# Altium schematic sheet infant_temperature_solar_1.SchDoc
size 431 x 279 mm
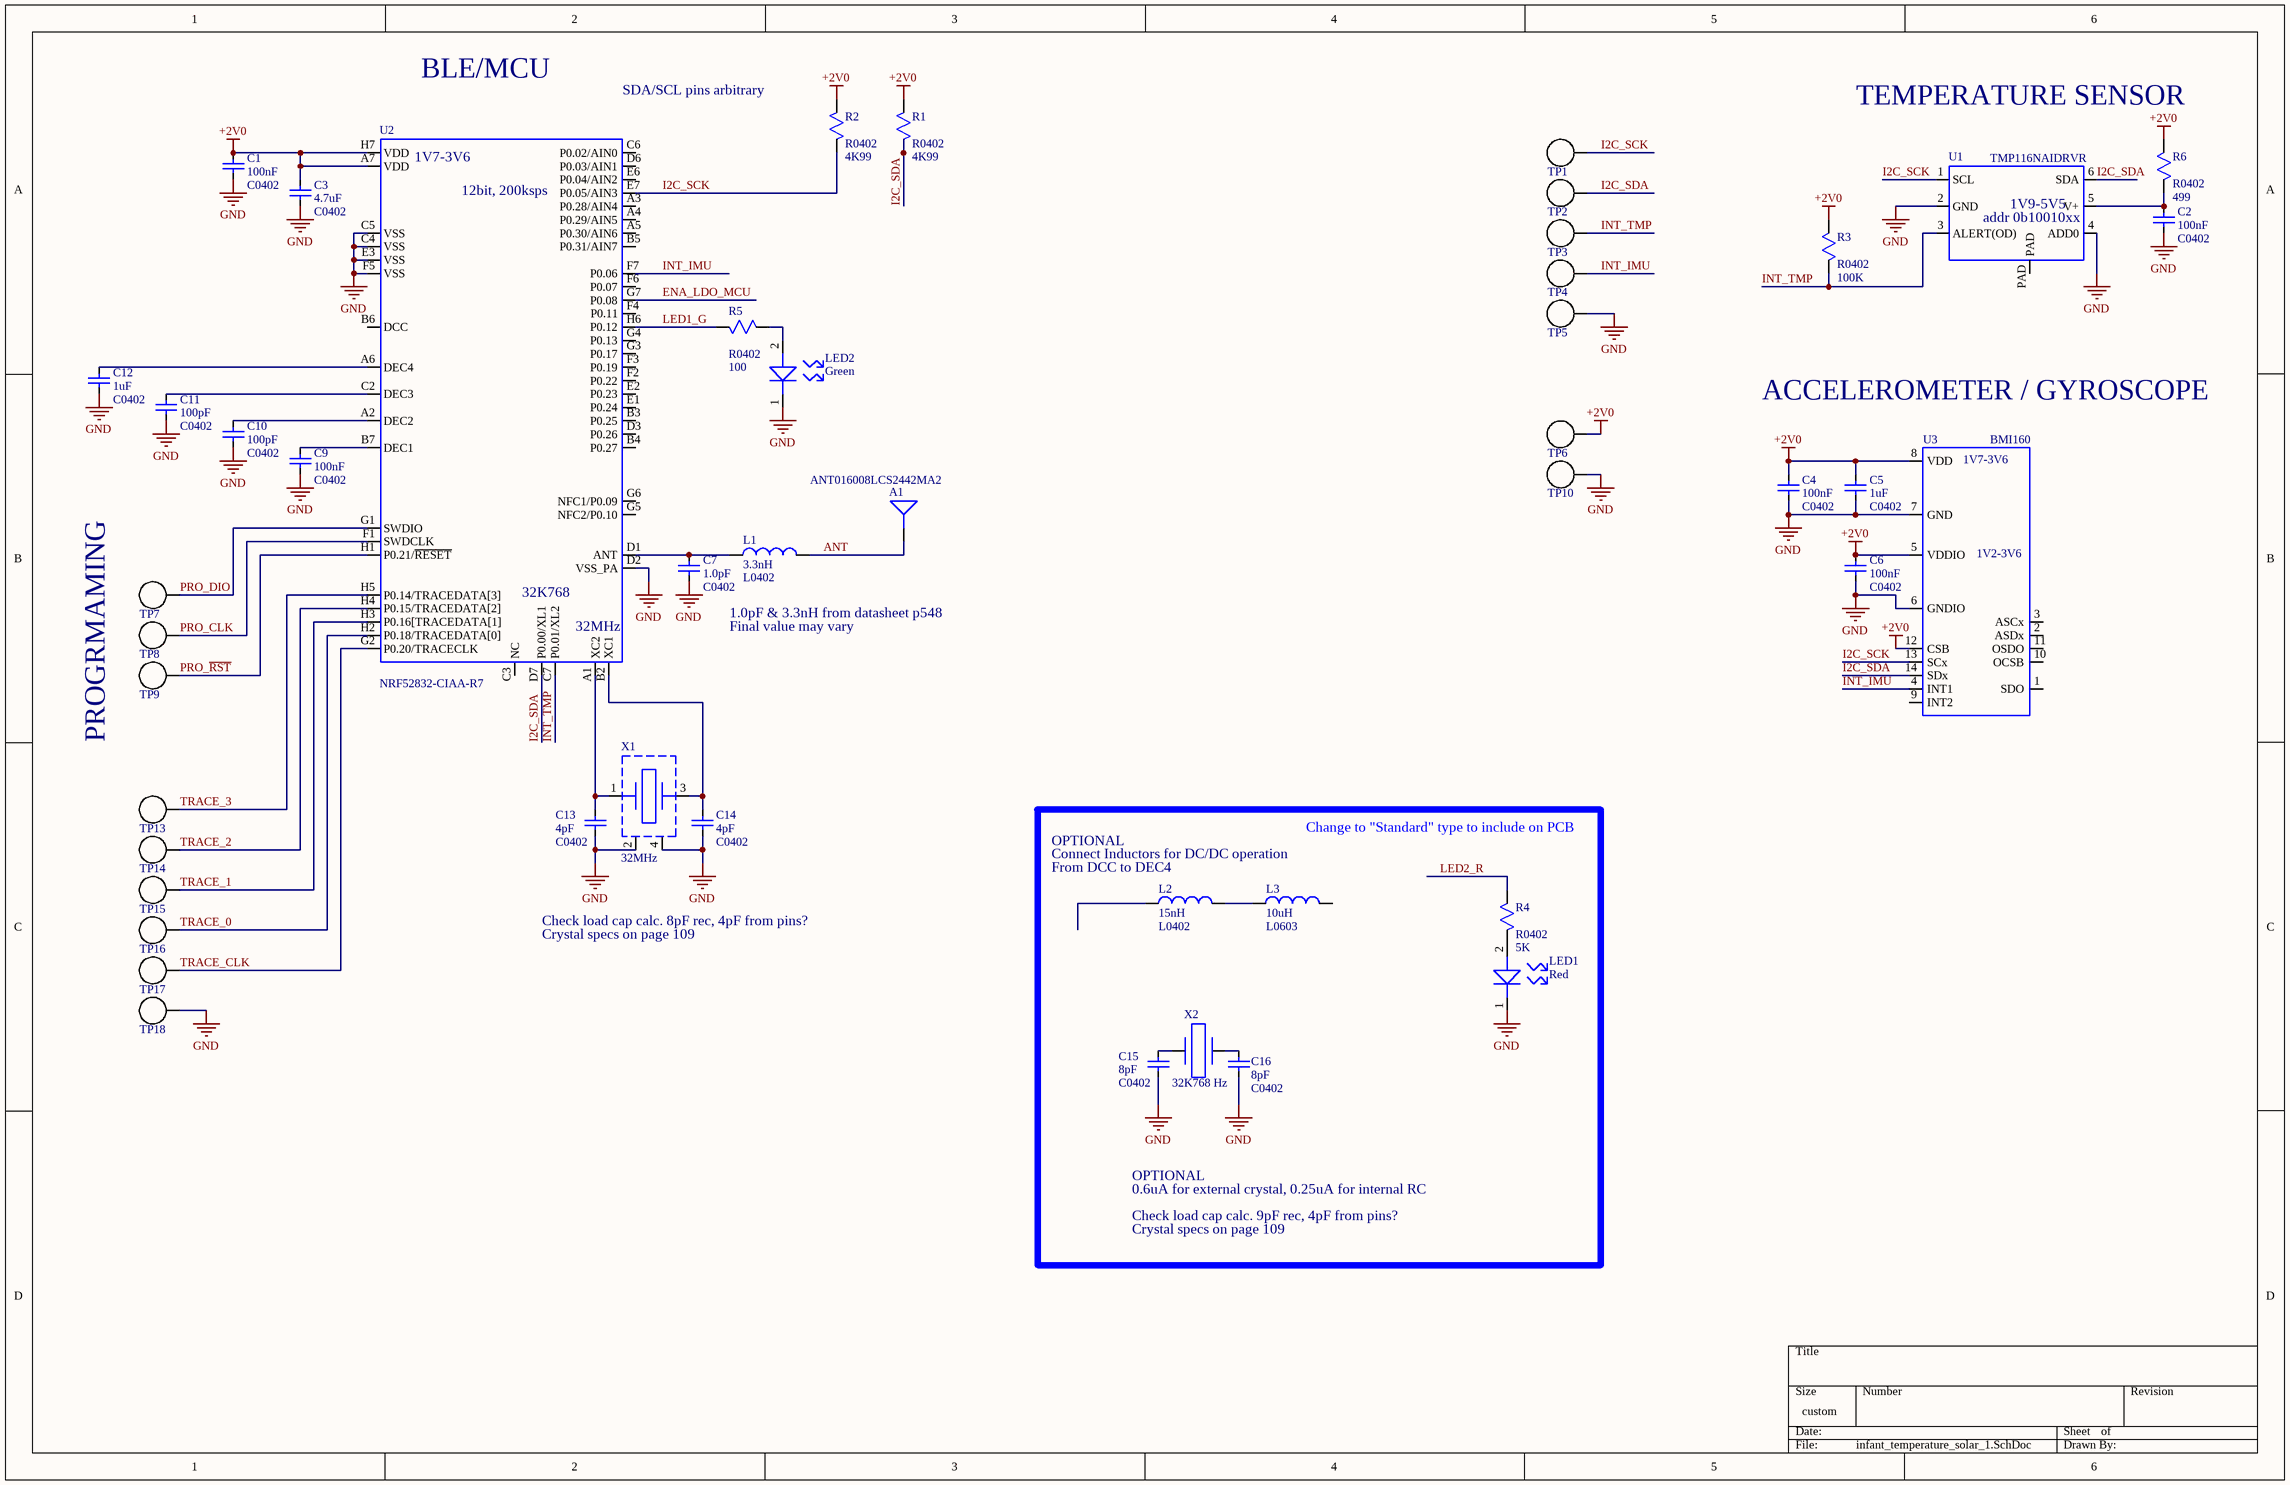
[diagram p0: infant_temperature_solar_1.SchDoc]

## Parts
A1  ANT016008LCS2442MA2  [ANT016008LCS]
C1  100nF  [C0402]
C2  100nF  [C0402]
C3  4.7uF  [C0402]
C4  100nF  [C0402]
C5  1uF  [C0402]
C6  100nF  [C0402]
C7  1.0pF  [C0402]
C9  100nF  [C0402]
C10  100pF  [C0402]
C11  100pF  [C0402]
C12  1uF  [C0402]
C13  4pF  [C0402]
C14  4pF  [C0402]
C15  8pF  [C0402]  (graphical)
C16  8pF  [C0402]  (graphical)
L1  value 3.3nH  [L0402]  (hidden comment: IND)
L2  value 15nH  [L0402]  (hidden comment: IND)  (graphical)
L3  value 10uH  [L0603]  (hidden comment: IND)  (graphical)
LED1  Red  [LED_0402]  (graphical)
LED2  Green  [LED_0402]
R1  value 4K99  [R0402]  (hidden comment: Resistor)
R2  value 4K99  [R0402]  (hidden comment: Resistor)
R3  value 100K  [R0402]  (hidden comment: Resistor)
R4  value 5K  [R0402]  (hidden comment: Resistor)  (graphical)
R5  value 100  [R0402]  (hidden comment: Resistor)
R6  value 499  [R0402]  (hidden comment: Resistor)
TP1  Not A Part  [TP_32AWG_1X0.5MM_ROUND]  (value not drawn)  (no BOM)
TP2  Not A Part  [TP_32AWG_1X0.5MM_ROUND]  (value not drawn)  (no BOM)
TP3  Not A Part  [TP_32AWG_1X0.5MM_ROUND]  (value not drawn)  (no BOM)
TP4  Not A Part  [TP_32AWG_1X0.5MM_ROUND]  (value not drawn)  (no BOM)
TP5  Not A Part  [TP_32AWG_1X0.5MM_ROUND]  (value not drawn)  (no BOM)
TP6  Not A Part  [TP_32AWG_1X0.5MM_ROUND]  (value not drawn)  (no BOM)
TP7  Not A Part  [TP_32AWG_1X0.5MM_ROUND]  (value not drawn)  (no BOM)
TP8  Not A Part  [TP_32AWG_1X0.5MM_ROUND]  (value not drawn)  (no BOM)
TP9  Not A Part  [TP_32AWG_1X0.5MM_ROUND]  (value not drawn)  (no BOM)
TP10  Not A Part  [TP_32AWG_1X0.5MM_ROUND]  (value not drawn)  (no BOM)
TP13  Not A Part  [TP_32AWG_1X0.5MM_ROUND]  (value not drawn)  (no BOM)
TP14  Not A Part  [TP_32AWG_1X0.5MM_ROUND]  (value not drawn)  (no BOM)
TP15  Not A Part  [TP_32AWG_1X0.5MM_ROUND]  (value not drawn)  (no BOM)
TP16  Not A Part  [TP_32AWG_1X0.5MM_ROUND]  (value not drawn)  (no BOM)
TP17  Not A Part  [TP_32AWG_1X0.5MM_ROUND]  (value not drawn)  (no BOM)
TP18  Not A Part  [TP_32AWG_1X0.5MM_ROUND]  (value not drawn)  (no BOM)
U1  MfgPartNumber: TMP116NAIDRVR  [WSON-6_PAD]  (hidden comment: TMP116)
U2  MfgPartNumber: NRF52832-CIAA-R7  [XFBGA-50]  (hidden comment: NRF52832_BGA)
U3  MfgPartNumber: BMI160  [LGA-14]  (hidden comment: BMI160_ALTERNATE)
X1  32MHz  [CRYSTAL_1MM6_X_1MM2]
X2  32K768 Hz  [CRYSTAL_1MM2_X_1MM0]  (graphical)

## Nets
+2V0: C1.1 C3.1 C4.1 C5.1 C6.1 R1.1 R2.1 R3.1 R6.1 TP6.1(MTG) U2.A7(VDD) U2.H7(VDD) U3.5(VDDIO) U3.8(VDD) U3.12(CSB)
GND: C1.2 C2.2 C3.2 C4.2 C5.2 C6.2 C7.2 C9.2 C10.2 C11.2 C12.2 C13.1 C14.1 C15.1 C16.1 LED1.1 LED2.1 TP5.1(MTG) TP10.1(MTG) TP18.1(MTG) U1.2(GND) U1.4(ADD0) U2.C4(VSS) U2.C5(VSS) U2.D2(VSS_PA) U2.E3(VSS) U2.F5(VSS) U3.6(GNDIO) U3.7(GND) X1.2(GND) X1.4(GND)
ANT: A1.4(FEED) L1.2
ENA_LDO_MCU: U2.G7(P0.08)
I2C_SCK: R2.2 TP1.1(MTG) U1.1(SCL) U2.E7(P0.05/AIN3) U3.13(SCx)
I2C_SDA: R1.2 TP2.1(MTG) U1.6(SDA) U2.D7(P0.00/XL1) U3.14(SDx)
INT_IMU: TP4.1(MTG) U2.F7(P0.06) U3.4(INT1)
INT_TMP: R3.2 TP3.1(MTG) U1.3(ALERT(OD)) U2.C7(P0.01/XL2)
LED1_G: R5.1 U2.H6(P0.12)
LED2_R: R4.1
PRO_CLK: TP8.1(MTG) U2.F1(SWDCLK)
PRO_DIO: TP7.1(MTG) U2.G1(SWDIO)
PRO_~{RST}: TP9.1(MTG) U2.H1(P0.21/~{RESET})
TRACE_0: TP16.1(MTG) U2.H2(P0.18/TRACEDATA[0])
TRACE_1: TP15.1(MTG) U2.H3(P0.16[TRACEDATA[1])
TRACE_2: TP14.1(MTG) U2.H4(P0.15/TRACEDATA[2])
TRACE_3: TP13.1(MTG) U2.H5(P0.14/TRACEDATA[3])
TRACE_CLK: TP17.1(MTG) U2.G2(P0.20/TRACECLK)
NetC2_1: C2.1 R6.2 U1.5(V+)
NetC7_1: C7.1 L1.1 U2.D1(ANT)
NetC9_1: C9.1 U2.B7(DEC1)
NetC10_1: C10.1 U2.A2(DEC2)
NetC11_1: C11.1 U2.C2(DEC3)
NetC12_1: C12.1 U2.A6(DEC4)
NetC13_2: C13.2 U2.A1(XC2) X1.1
NetC14_2: C14.2 U2.B2(XC1) X1.3
NetC15_2: C15.2 X2.2
NetC16_2: C16.2 X2.1
NetL2_2: L2.2 L3.1
NetLED1_2: LED1.2 R4.2
NetLED2_2: LED2.2 R5.2

Not connected (* = marked no-connect by the designer): L2 1; L3 2; U1 PAD; U2 A3(P0.28/AIN4) A4(P0.29/AIN5) A5(P0.30/AIN6) B3(P0.25) B4(P0.27) B5(P0.31/AIN7) B6(DCC) C3(NC) C6(P0.02/AIN0) D3(P0.26) D6(P0.03/AIN1) E1(P0.24) E2(P0.23) E6(P0.04/AIN2) F2(P0.22) F3(P0.19) F4(P0.11) F6(P0.07) G3(P0.17) G4(P0.13) G5(NFC2/P0.10) G6(NFC1/P0.09); U3 1(SDO) 2(ASDx) 3(ASCx) 9(INT2) 10(OCSB) 11(OSDO)

## Notes on the sheet
- BLE/MCU
- SDA/SCL pins arbitrary
- TEMPERATURE SENSOR
- ACCELEROMETER / GYROSCOPE
- 1.0pF & 3.3nH from datasheet p548
- Final value may vary
- PROGRMAMING
- Change to "Standard" type to include on PCB
- Connect Inductors for DC/DC operation
- OPTIONAL
- (near L2) From DCC to DEC4
- Crystal specs on page 109
- Check load cap calc. 8pF rec, 4pF from pins?
- Check load cap calc. 9pF rec, 4pF from pins?
- 0.6uA for external crystal, 0.25uA for internal RC
- (in symbol BMI160_ALTERNATE) 1V7-3V6; 1V2-3V6
- (in symbol NRF52832_BGA) 1V7-3V6; 12bit, 200ksps; 32K768; 32MHz
- (in symbol TMP116) 1V9-5V5; addr 0b10010xx

## Library data of the parts
A1 = ANT016008LCS2442MA2: ANTENNA 2.4GHZ SMD; Manufacturer: TDK; DigikeyPartNumber: 445-172405CT-ND; MfgPartNumber: ANT016008LCS2442MA2
C1 C2 C4 C6 C9 = CAP: Nonpolarized capacitor; Manufacturer: Samsung; MfgPartNumber: CL05F104ZA5NNNC; VoltageRating: 25V; DigikeyPartNumber: 1276-1739-1-ND; Value: 100nF; Package: C0402
C3 = CAP: Nonpolarized capacitor; Manufacturer: Murata; MfgPartNumber: GRM155R61A475MEAAD; VoltageRating: 10V; DigikeyPartNumber: 490-14306-1-ND; Value: 4.7uF; Package: C0402
C5 C12 = CAP: Nonpolarized capacitor; Manufacturer: Taiyo Yuden; MfgPartNumber: TMK105BJ105MV-F; VoltageRating: 25V; DigikeyPartNumber: 587-3245-1-ND; Value: 1uF; Package: C0402
C7 = CAP: Nonpolarized capacitor; Manufacturer: Murata; MfgPartNumber: GRM1555C1E1R0BA01D; VoltageRating: 25V; DigikeyPartNumber: 490-11362-1-ND; Value: 1.0pF; Package: C0402
C10 C11 = CAP: Nonpolarized capacitor; Manufacturer: Yageo; MfgPartNumber: CC0402KRX7R8BB101; VoltageRating: 25V; DigikeyPartNumber: 311-3807-1-ND; Value: 100pF; Package: C0402
C13 C14 = CAP: Nonpolarized capacitor; Manufacturer: Murata; MfgPartNumber: GRM1555C1H4R0CA01D; VoltageRating: 50V; Value: 4pF; Package: C0402; ClassName: MCU; DigikeyPartNumber: 490-5873-1-ND
C15 C16 = CAP: Nonpolarized capacitor; Manufacturer: Lookup; VoltageRating: 10V; Value: 8pF; Package: C0402; ClassName: MCU; DigikeyPartNumber: Lookup; MfgPartNumber: Lookup
L1 = IND: Inductor; Manufacturer: Murata; MfgPartNumber: LQW15AN3N3B80D; DigikeyPartNumber: 490-7641-1-ND; Package: L0402
L2 L3 = IND: Inductor; Manufacturer: Lookup; MfgPartNumber: Lookup; DigikeyPartNumber: Lookup
  L2: Package: L0402
  L3: Package: L0603
LED1 = LED: Manufacturer: Lookup; Package: LED_0402; MfgPartNumber: Lookup; DigikeyPartNumber: Lookup; Color: Red
LED2 = LED: Manufacturer: Kingbright; MfgPartNumber: APHHS1005LCGCK; Package: LED_0402; DigikeyPartNumber: 754-2121-1-ND; Color: Green
R1 R2 = RES: Manufacturer: Panasonic; MfgPartNumber: ERJ-2RKF4991X; Tolerance: 1%; DigikeyPartNumber: P4.99KLCT-ND
R3 = RES: Manufacturer: Yageo; MfgPartNumber: RT0402FRE07100KL; Tolerance: 1%; DigikeyPartNumber: YAG2307CT-ND
R4 = RES: Manufacturer: Lookup; Tolerance: 1%; MfgPartNumber: Lookup; DigikeyPartNumber: Lookup
R5 = RES: Manufacturer: Yageo; MfgPartNumber: RC0100FR-07100RL; Tolerance: 1%; DigikeyPartNumber: 311-100DGCT-ND
R6 = RES: Manufacturer: Panasonic; MfgPartNumber: ERJ-2RKF4990X; Tolerance: 1%; DigikeyPartNumber: P499LCT-ND
TP1-TP10 TP13-TP18 = TP_32AWG: 0.305mm (12mil) hole for 32AWG wire. No BOM item.
U1 = TMP116: Temperature Sensor Digital, Local -55°C ~ 125°C 16 b 6-WSON (2x2); Manufacturer: Texas Instruments; DigikeyPartNumber: 296-48306-1-ND
U2 = NRF52832_BGA: Bluetooth Low Energy 50-XFBGA; Manufacturer: Nordic Semiconductor ASA; DigikeyPartNumber: 1490-1066-1-ND
U3 = BMI160_ALTERNATE: IMU ACCEL/GYRO I2C/SPI 14LGA; Manufacturer: Bosch; DigikeyPartNumber: 828-1057-1-ND
X1 = CRYSTAL_32MHz: CRYSTAL 32.0000MHZ 8PF SMD; Manufacturer: Diodes Inc.; MfgPartNumber: US3200005Z; DigikeyPartNumber: US3200005ZCT-ND; Package: CRYSTAL_1MM6_X_1MM2
X2 = CRYSTAL_32K768_1MM2_X_1MM0: 32.768kHz ±20ppm Crystal 9pF 90 kOhms 2-SMD, No Lead; Manufacturer: ECS Inc.; MfgPartNumber: ECS-.327-9-1210-TR; DigikeyPartNumber: XC2283CT-ND; Package: CRYSTAL_1MM2_X_1MM0